# Altium schematic sheet [1]- Schematic Blocks.SchDoc: Mixed Signal Board
size A4; Author: AVIRAL MISHRA; DocumentNumber: 1; SheetNumber: 1; SheetTotal: 11; PROJECT CODE: A_V1.0
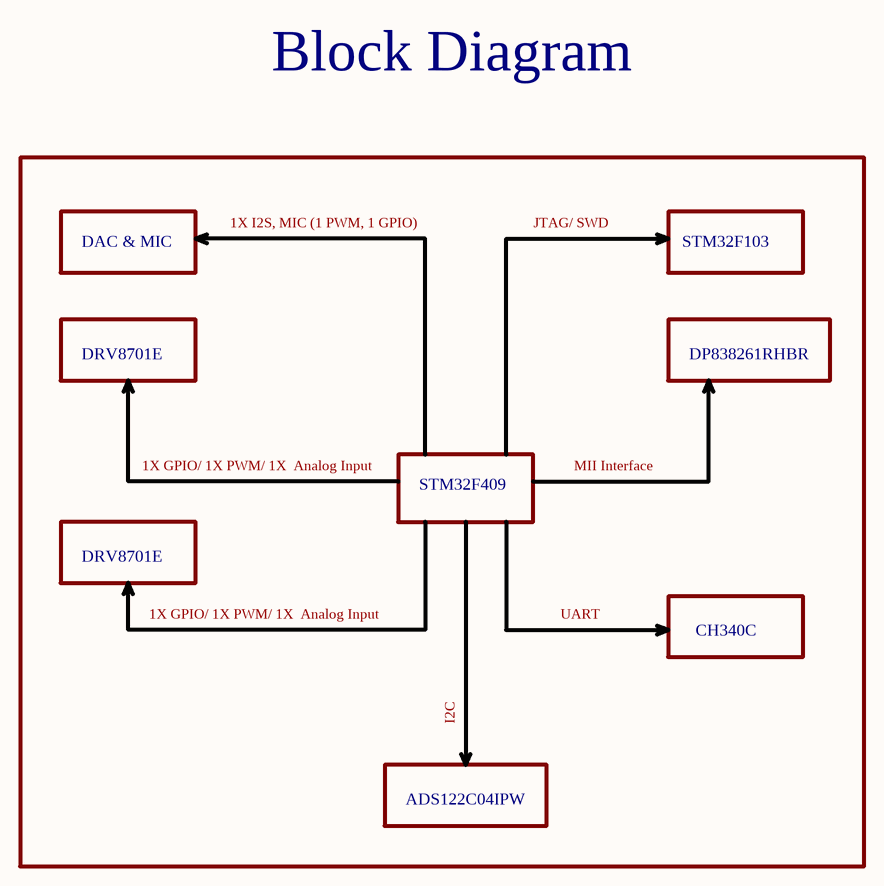
[diagram p0: [1]- Schematic Blocks.SchDoc]

## Notes on the sheet
- Block Diagram
- 1X I2S, MIC (1 PWM, 1 GPIO)
- JTAG/ SWD
- DAC & MIC
- STM32F103
- DRV8701E
- DP838261RHBR
- 1X GPIO/ 1X PWM/ 1X  Analog Input
- STM32F409
- MII Interface
- UART
- CH340C
- I2C
- ADS122C04IPW
- TITLE:
- DOCUMENT NAME:
- SCALE 1:1
- This document is copyright of EsteemPCB and shall not be revealed, produced, copied, in whole or in part, nor
- PROJECT CODE:
- TEMPLATE:
- A4
- AUTHOR:
- Sheet
- of
- used for any purpose other than submitted.